# Altium project Fan_Controller_v1.2.PrjPcb
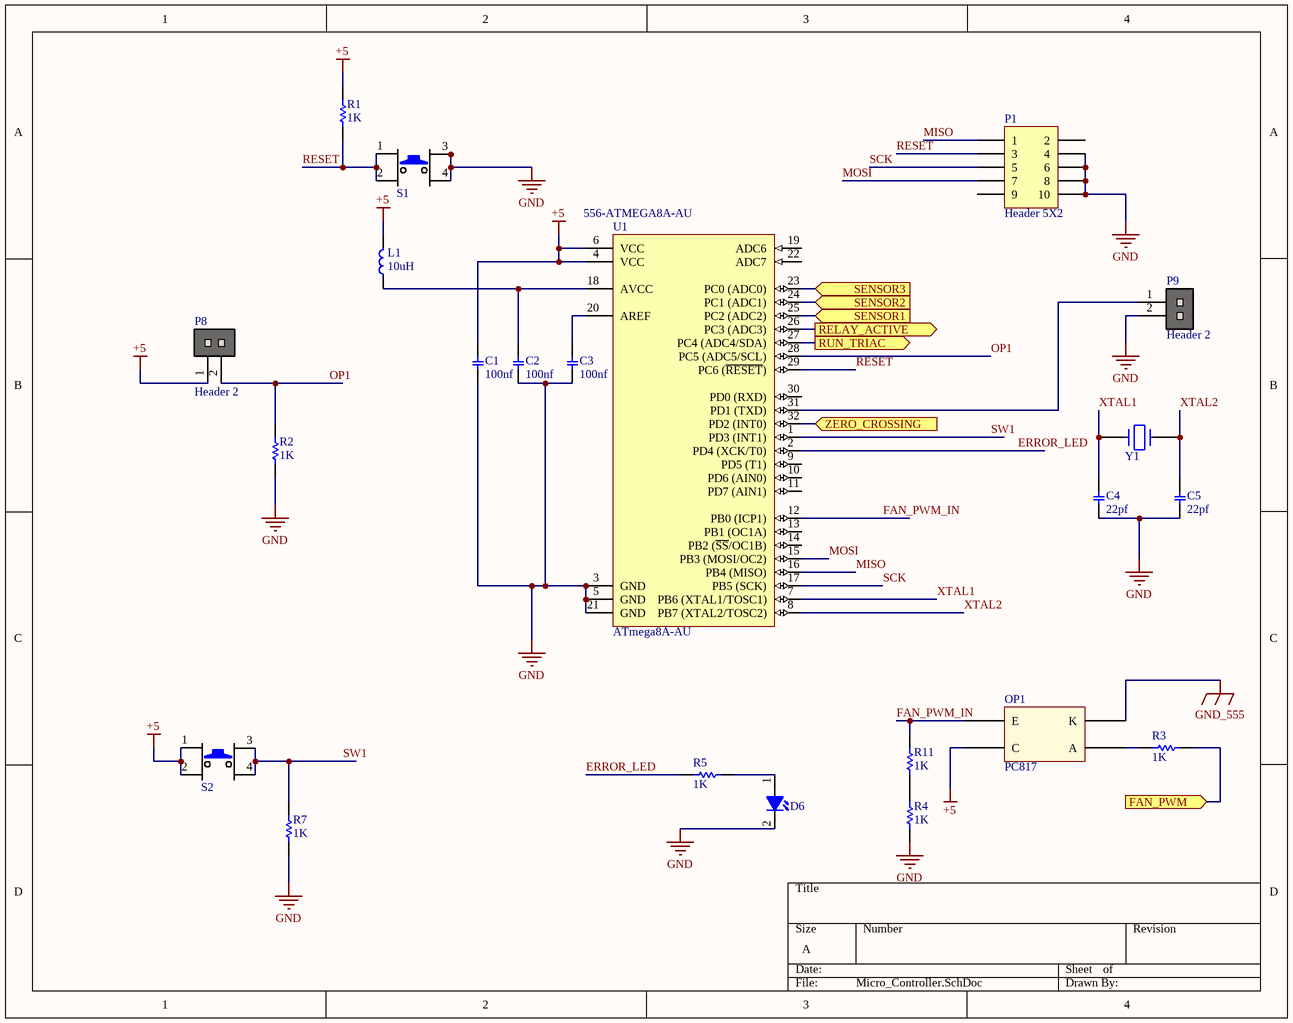
[diagram p0: Micro_Controller.SchDoc]
6 sheets, 94 parts. Net scope: flat (ports and power ports of the same name join across sheets).
Board file: PCB.PcbDoc
Sheets:
  Micro_Controller.SchDoc
  Fan_Feedback.SchDoc
  Motor_Controller.SchDoc
  Relay_Alert.SchDoc
  Power.SchDoc
  Sensors.SchDoc

## Sheet Micro_Controller.SchDoc
size A

### Parts
C1  value 100nf  [C1206]  (hidden comment: Capacitor C SMD 1206)
C2  value 100nf  [C1206]  (hidden comment: Capacitor C SMD 1206)
C3  value 100nf  [C1206]  (hidden comment: Capacitor C SMD 1206)
C4  value 22pf  [C1206]  (hidden comment: Capacitor C SMD 1206)
C5  value 22pf  [C1206]  (hidden comment: Capacitor C SMD 1206)
D6  LED THD 3mm  [LED THD 3mm (Green)]  (value not drawn)
L1  value 10uH  [L1206]  (hidden comment: Inductor SMD NC 1206)
OP1  PC817  [PC817 SMD]
P1  Header 5X2  [HDR2X5]
P8  Header 2  [HDR 1X2]
P9  Header 2  [HDR 1X2]
R1  value 1K  [SMD-1206-RES]  (hidden comment: Resistor SMD 1206)
R2  value 1K  [SMD-1206-RES]  (hidden comment: Resistor SMD 1206)
R3  value 1K  [SMD-1206-RES]  (hidden comment: Resistor SMD 1206)
R4  value 1K  [SMD-1206-RES]  (hidden comment: Resistor SMD 1206)
R5  value 1K  [SMD-1206-RES]  (hidden comment: Resistor SMD 1206)
R7  value 1K  [SMD-1206-RES]  (hidden comment: Resistor SMD 1206)
R11  value 1K  [SMD-1206-RES]  (hidden comment: Resistor SMD 1206)
S1  SW_PB4 THD  [SW THD 4 PIN (6)]  (value not drawn)
S2  SW_PB4 THD  [SW THD 4 PIN (6)]  (value not drawn)
U1  ATmega8A-AU  Supplier Part Number 1: 556-ATMEGA8A-AU  [32A_N]
Y1  Crystal  [Crystal 5 16MHZ]  (value not drawn)

### Ports
FAN_PWM (in), RELAY_ACTIVE (out), RUN_TRIAC (out), SENSOR1 (in), SENSOR2 (in), SENSOR3 (in), ZERO_CROSSING (in)

### Nets
+5: C1.2 L1.2 OP1.4(C) P8.1 R1.2 S2.1 S2.2 U1.4(VCC) U1.6(VCC)
GND: C1.1 C2.1 C3.1 C4.1 C5.1 D6.2(CATHODE) P1.4 P1.6 P1.8 P1.10 P9.2 R2.1 R4.1 R7.1 S1.3 S1.4 U1.3(GND) U1.5(GND) U1.21(GND)
GND_555: OP1.2(K)
ERROR_LED: R5.1 U1.2(PD4_(XCK/T0))
FAN_PWM_IN: OP1.3(E) R11.2 U1.12(PB0_(ICP1))
MISO: P1.1 U1.16(PB4_(MISO))
MOSI: P1.7 U1.15(PB3_(MOSI/OC2))
OP1: P8.2 R2.2 U1.28(PC5_(ADC5/SCL))
RESET: P1.3 R1.1 S1.1 S1.2 U1.29(PC6_(~{RESET}))
SCK: P1.5 U1.17(PB5_(SCK))
SW1: R7.2 S2.3 S2.4 U1.1(PD3_(INT1))
XTAL1: C4.2 U1.7(PB6_(XTAL1/TOSC1)) Y1.1
XTAL2: C5.2 U1.8(PB7_(XTAL2/TOSC2)) Y1.2
NetC2_2: C2.2 L1.1 U1.18(AVCC)
NetC3_2: C3.2 U1.20(AREF)
NetC23_2: U1.25(PC2_(ADC2)) ; port SENSOR1
NetC24_2: U1.24(PC1_(ADC1)) ; port SENSOR2
NetC25_2: U1.23(PC0_(ADC0)) ; port SENSOR3
NetConn1_4: R3.2 ; port FAN_PWM
NetD6_1: D6.1(ANODE) R5.2
NetOP1_1: OP1.1(A) R3.1
NetOP2_3: U1.32(PD2_(INT0)) ; port ZERO_CROSSING
NetP9_1: P9.1 U1.31(PD1_(TXD))
NetR4_2: R4.2 R11.1
NetR14_1: U1.27(PC4_(ADC4/SDA)) ; port RUN_TRIAC
NetR18_2: U1.26(PC3_(ADC3)) ; port RELAY_ACTIVE

Not connected (* = marked no-connect by the designer): P1 2 9; U1 9(PD5_(T1)) 10(PD6_(AIN0)) 11(PD7_(AIN1)) 13(PB1_(OC1A)) 14(PB2_(~{SS}/OC1B)) 19(ADC6) 22(ADC7) 30(PD0_(RXD))

### Library data of the parts
OP1 = PC817: PC817 optocpler; ComponentLink2Description: Website Smart World; ComponentLink2URL: https://www.smartw.ir/; ComponentLink3Description: Telegram; ComponentLink3URL: https://t.me/altium_smartw; ComponentLink4Description: Instagram; ComponentLink4URL: https://Instagram.com/smartgw.ir; DatasheetVersion: 2021
P1 = Header 5X2: Header, 5-Pin, Dual row; LatestRevisionDate: 17-Jul-2002; LatestRevisionNote: Re-released for DXP Platform.; Publisher: Altium Limited
P8 P9 = Header 2: Header, 2-Pin; ComponentLinkp-URL: https://www.smartw.ir/; DatasheetVersion: 2020
U1 = ATmega8A-AU: 8-bit AVR Microcontroller, 8KB Flash, 512 Bytes EEPROM, 1KB SRAM, 32-pin TQFP, Industrial Grade (-40°C to 85°C); ComponentLink1Description: Website Smart World; ComponentLink1URL: https://www.smartw.ir/; Supplier 1: Mouser
C1-C5 = Capacitor C SMD 1206: DatasheetVersion: 2021; ComponentLink1Description: Website Smart World; ComponentLink1URL: https://www.smartw.ir/; ComponentLink2Description: Telegram; ComponentLink2URL: https://t.me/altium_smartw; ComponentLink3Description: Instagram; ComponentLink3URL: https://Instagram.com/smartgw.ir
D6 = LED THD 3mm: ComponentLink1Description: Website Smart World; ComponentLink1URL: https://www.smartw.ir/; ComponentLink2Description: Telegram; ComponentLink2URL: https://t.me/altium_smartw; ComponentLink3Description: Instagram; ComponentLink3URL: https://Instagram.com/smartgw.ir; DatasheetVersion: 2021
L1 = Inductor SMD NC 1206: DatasheetVersion: 2021; ComponentLink1Description: Website Smart World; ComponentLink1URL: https://www.smartw.ir/; ComponentLink2Description: Telegram; ComponentLink2URL: https://t.me/altium_smartw; ComponentLink3Description: Instagram; ComponentLink3URL: https://Instagram.com/smartgw.ir
R1-R5 R7 R11 = Resistor SMD 1206: DatasheetVersion: 2021; ComponentLink1Description: Website Smart World; ComponentLink1URL: https://www.smartw.ir/; ComponentLink2Description: Telegram; ComponentLink2URL: https://t.me/altium_smartw; ComponentLink3Description: Instagram; ComponentLink3URL: https://Instagram.com/smartgw.ir
S1 S2 = SW_PB4 THD: ComponentLink1Description: Website Smart World; ComponentLink1URL: https://www.smartw.ir/; ComponentLink2Description: Telegram; ComponentLink2URL: https://t.me/altium_smartw; ComponentLink3Description: Instagram; ComponentLink3URL: https://Instagram.com/smartgw.ir; DatasheetVersion: 2021
Y1 = Crystal: ComponentLink1Description: Website Smart World; ComponentLink1URL: https://www.smartw.ir/; ComponentLink2Description: Telegram; ComponentLink2URL: https://t.me/altium_smartw; ComponentLink3Description: Instagram; ComponentLink3URL: https://Instagram.com/smartgw.ir; DatasheetVersion: 2021

## Sheet Fan_Feedback.SchDoc
size A
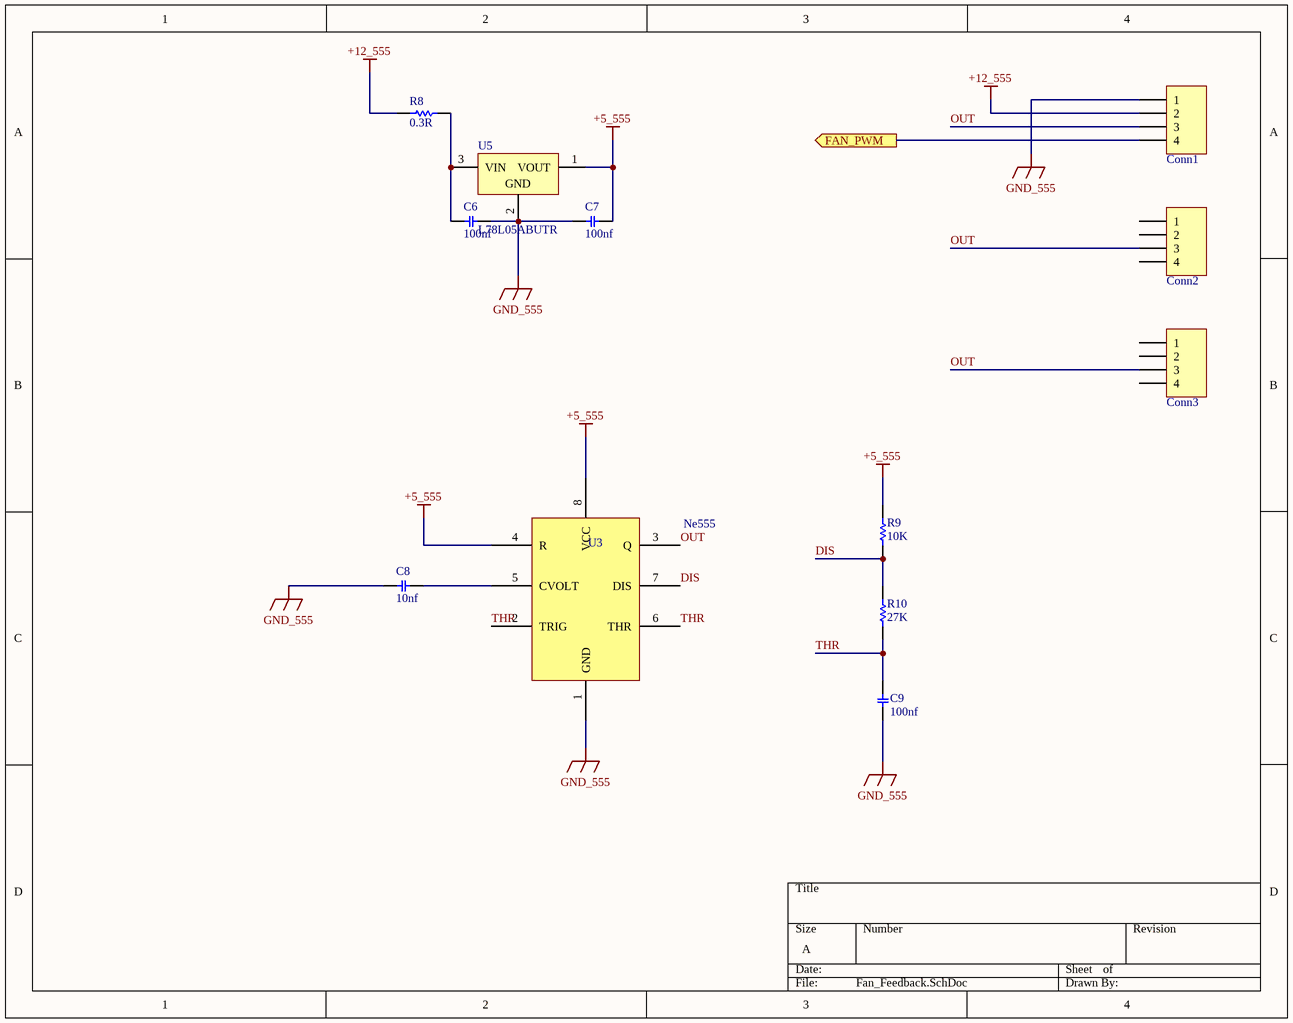
[diagram p1: Fan_Feedback.SchDoc]

### Parts
C6  value 100nf  [C1206]  (hidden comment: Capacitor C SMD 1206)
C7  value 100nf  [C1206]  (hidden comment: Capacitor C SMD 1206)
C8  value 10nf  [C1206]  (hidden comment: Capacitor C SMD 1206)
C9  value 100nf  [C1206]  (hidden comment: Capacitor C SMD 1206)
Conn1  Telecommunications_4pin  [Teleconn_4pin]  (value not drawn)
Conn2  Telecommunications_4pin  [Teleconn_4pin]  (value not drawn)
Conn3  Telecommunications_4pin  [Teleconn_4pin]  (value not drawn)
R8  value 0.3R  [SMD-1206-RES]  (hidden comment: Resistor SMD 1206)
R9  value 10K  [SMD-1206-RES]  (hidden comment: Resistor SMD 1206)
R10  value 27K  [SMD-1206-RES]  (hidden comment: Resistor SMD 1206)
U3  NE555  [NE555 SMD]
U5  L78L05ABUTR  [SOT-89_N]

### Ports
FAN_PWM (out)

### Nets
+5_555: C7.2 R9.2 U3.4(R) U3.8(VCC) U5.1(VOUT)
+12_555: Conn1.2 R8.1
GND_555: C6.2 C7.1 C8.1 C9.1 Conn1.1 U3.1(GND) U5.2(GND)
DIS: R9.1 R10.2 U3.7(DIS)
OUT: Conn1.3 Conn2.3 Conn3.3 U3.3(Q)
THR: C9.2 R10.1 U3.2(TRIG) U3.6(THR)
NetC6_1: C6.1 R8.2 U5.3(VIN)
NetC8_2: C8.2 U3.5(CVOLT)
NetConn1_4: Conn1.4 ; port FAN_PWM

Not connected (* = marked no-connect by the designer): Conn2 1 2 4; Conn3 1 2 4

### Library data of the parts
Conn1-Conn3 = Telecommunications_4pin: Telecommunications; ComponentLink1Description: Website Smart World; ComponentLink1URL: https://www.smartw.ir/; ComponentLink2Description: Telegram; ComponentLink2URL: https://t.me/altium_smartw; ComponentLink3Description: Instagram; ComponentLink3URL: https://Instagram.com/smartgw.ir; DatasheetVersion: 2021
U3 = NE555 2: ComponentLink1Description: Website Smart World; ComponentLink1URL: https://www.smartw.ir/; ComponentLink2Description: Telegram; ComponentLink2URL: https://t.me/altium_smartw; ComponentLink3Description: Instagram; ComponentLink3URL: https://Instagram.com/smartgw.ir; DatasheetVersion: 2021; Value: Ne555
U5 = CMP-0244-00406-1: Positive Voltage Regulator, 5V, 4-Pin SOT-89, Tape and Reel; PackageVersion: 2011; DatasheetVersion: 1/02/2011; PackageDescription: 3-Pin SOT-89 Package 1.5 mm Pitch, 4.1 mm Lead Span; PackageReference: SOT-89; ComponentLink2Description: Datasheet; ComponentLink1URL: http://www.st.com; ComponentLink1Description: Manufacturer URL; ComponentLink2URL: http://www.st.com/internet/com/TECHNICAL_RESOURCES/TECHNICAL_LITERATURE/DATASHEET/CD00000446.pdf
C6-C9 = Capacitor C SMD 1206: DatasheetVersion: 2021; ComponentLink1Description: Website Smart World; ComponentLink1URL: https://www.smartw.ir/; ComponentLink2Description: Telegram; ComponentLink2URL: https://t.me/altium_smartw; ComponentLink3Description: Instagram; ComponentLink3URL: https://Instagram.com/smartgw.ir
R8-R10 = Resistor SMD 1206: DatasheetVersion: 2021; ComponentLink1Description: Website Smart World; ComponentLink1URL: https://www.smartw.ir/; ComponentLink2Description: Telegram; ComponentLink2URL: https://t.me/altium_smartw; ComponentLink3Description: Instagram; ComponentLink3URL: https://Instagram.com/smartgw.ir

## Sheet Motor_Controller.SchDoc
size A
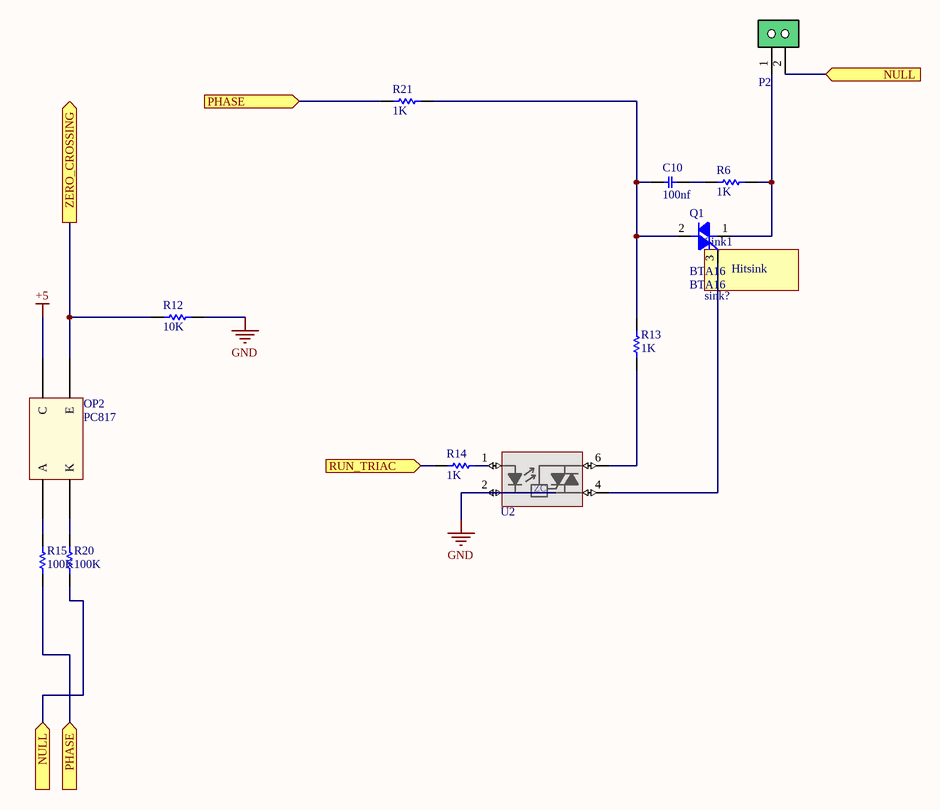
[diagram p2: Motor_Controller.SchDoc]

### Parts
C10  value 100nf  [C_PLY_13X5]  (hidden comment: Capacitor Polyester THD)
OP2  PC817  [PC817 SMD]
P2  Phoenix 2  [PRKR2A]  (value not drawn)
Q1  BTA16  [TO220]
R6  value 1K  [R05W_AX05]  (hidden comment: Resistor THD)
R12  value 10K  [SMD-1206-RES]  (hidden comment: Resistor SMD 1206)
R13  value 1K  [SMD-1206-RES]  (hidden comment: Resistor SMD 1206)
R14  value 1K  [SMD-1206-RES]  (hidden comment: Resistor SMD 1206)
R15  value 100K  [R2W_AX08]  (hidden comment: Resistor THD)
R20  value 100K  [R2W_AX08]  (hidden comment: Resistor THD)
R21  value 1K  [SMD-1206-RES]  (hidden comment: Resistor SMD 1206)
Sink1  sink?  [heatsink (4)]
U2  MOC30XX  [DIP-6 white]  (value not drawn)

### Ports
NULL (in), PHASE (in), RUN_TRIAC (in), ZERO_CROSSING (out)

### Nets
+5: OP2.4(C)
GND: R12.2 U2.2(K)
NetC10_1: C10.1 Q1.2(T2) R13.2 R21.2
NetC10_2: C10.2 R6.1
NetDB1_4: P2.2 R20.1 ; port NULL
NetOP2_1: OP2.1(A) R15.2
NetOP2_2: OP2.2(K) R20.2
NetOP2_3: OP2.3(E) R12.1 ; port ZERO_CROSSING
NetP2_1: P2.1 Q1.1(T1) R6.2
NetP4_2: R15.1 R21.1 ; port PHASE
NetQ1_3: Q1.3(G) U2.4(T2)
NetR13_1: R13.1 U2.6(T1)
NetR14_1: R14.1 ; port RUN_TRIAC
NetR14_2: R14.2 U2.1(A)

### Notes on the sheet
- (in symbol MOC30XX) ZC

### Library data of the parts
OP2 = PC817: PC817 optocpler; ComponentLink2Description: Website Smart World; ComponentLink2URL: https://www.smartw.ir/; ComponentLink3Description: Telegram; ComponentLink3URL: https://t.me/altium_smartw; ComponentLink4Description: Instagram; ComponentLink4URL: https://Instagram.com/smartgw.ir; DatasheetVersion: 2021
Q1 = BTA16: Triac, 800V, 16A, TO-220; ComponentLink1Description: Website Smart World; ComponentLink1URL: https://www.smartw.ir/; ComponentLink2Description: Telegram; ComponentLink2URL: https://t.me/altium_smartw; ComponentLink3Description: Instagram; ComponentLink3URL: https://Instagram.com/smartgw.ir; DatasheetVersion: 2021; VALUE: BTA16
Sink1 = Hitsink
U2 = MOC30XX: Single Channel Zero-Crossing Random-Phase Optoisolators Triac Driver (600 Volt Peak) , Isolation Voltage 7500Vac(pk); ComponentLink1Description: Website Smart World; ComponentLink1URL: https://www.smartw.ir/; ComponentLink2Description: Telegram; ComponentLink2URL: https://t.me/altium_smartw; ComponentLink3Description: Instagram; ComponentLink3URL: https://Instagram.com/smartgw.ir; DatasheetVersion: 2021
C10 = Capacitor Polyester THD: DatasheetVersion: 2021; ComponentLink1Description: Website Smart World; ComponentLink1URL: https://www.smartw.ir/; ComponentLink2Description: Telegram; ComponentLink2URL: https://t.me/altium_smartw; ComponentLink3Description: Instagram; ComponentLink3URL: https://Instagram.com/smartgw.ir
P2 = Phoenix 2: ComponentLinkp-URL: https://www.smartw.ir/; DatasheetVersion: 2021; ComponentLink1Description: Website Smart World; ComponentLink1URL: https://www.smartw.ir/; ComponentLink2Description: Telegram; ComponentLink2URL: https://t.me/altium_smartw; ComponentLink3Description: Instagram; ComponentLink3URL: https://Instagram.com/smartgw.ir
R6 R15 R20 = Resistor THD: DatasheetVersion: 2021; ComponentLink1Description: Website Smart World; ComponentLink1URL: https://www.smartw.ir/; ComponentLink2Description: Telegram; ComponentLink2URL: https://t.me/altium_smartw; ComponentLink3Description: Instagram; ComponentLink3URL: https://Instagram.com/smartgw.ir
R12-R14 R21 = Resistor SMD 1206: DatasheetVersion: 2021; ComponentLink1Description: Website Smart World; ComponentLink1URL: https://www.smartw.ir/; ComponentLink2Description: Telegram; ComponentLink2URL: https://t.me/altium_smartw; ComponentLink3Description: Instagram; ComponentLink3URL: https://Instagram.com/smartgw.ir

## Sheet Relay_Alert.SchDoc
size A
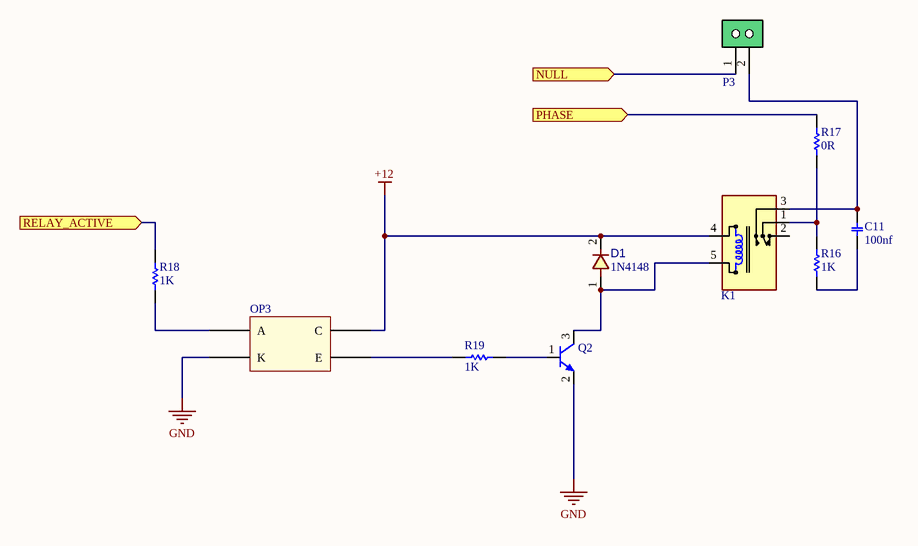
[diagram p3: Relay_Alert.SchDoc]

### Parts
C11  value 100nf  [C_PLY_13X5]  (hidden comment: Capacitor Polyester THD)
D1  value 1N4148  [D_SOD80]  (hidden comment: 1N4148 SMD)
K1  RELAY SPST 5 Pin Bache Millon  [REL_SPDT_5_1512]  (value not drawn)
OP3  PC817  [PC817 SMD]  (value not drawn)
P3  Phoenix 2  [PRKR2A]  (value not drawn)
Q2  BC847 NPN  [SOT-23]  (value not drawn)
R16  value 1K  [R05W_AX05]  (hidden comment: Resistor THD)
R17  value 0R  [SMD-1206-RES]  (hidden comment: Resistor SMD 1206)
R18  value 1K  [SMD-1206-RES]  (hidden comment: Resistor SMD 1206)
R19  value 1K  [SMD-1206-RES]  (hidden comment: Resistor SMD 1206)

### Ports
NULL (in), PHASE (in), RELAY_ACTIVE (in)

### Nets
+12: D1.2 K1.4(T1) OP3.4(C)
GND: OP3.2(K) Q2.2(E)
NetC11_1: C11.1 R16.1
NetC11_2: C11.2 K1.3(NO) P3.2
NetD1_1: D1.1 K1.5(T2) Q2.3(C)
NetDB1_4: P3.1 ; port NULL
NetK1_1: K1.1(COM) R16.2 R17.1
NetOP3_1: OP3.1(A) R18.1
NetOP3_3: OP3.3(E) R19.1
NetP4_2: R17.2 ; port PHASE
NetQ2_1: Q2.1(B) R19.2
NetR18_2: R18.2 ; port RELAY_ACTIVE

Not connected (* = marked no-connect by the designer): K1 2(NC)

### Library data of the parts
D1 = 1N4148 SMD: DIODE, FAST SWTICHING, 0.3A, 0.5W; DatasheetVersion: 2021; ComponentLink1Description: Website Smart World; ComponentLink1URL: https://www.smartw.ir/; ComponentLink2Description: Telegram; ComponentLink2URL: https://t.me/altium_smartw; ComponentLink3Description: Instagram; ComponentLink3URL: https://Instagram.com/smartgw.ir
K1 = RELAY SPST 5 Pin Bache Millon: Relay; ComponentLinkp-URL: https://www.smartw.ir/; DatasheetVersion: 2021; ComponentLink1Description: Website Smart World; ComponentLink1URL: https://www.smartw.ir/; ComponentLink2Description: Telegram; ComponentLink2URL: https://t.me/altium_smartw; ComponentLink3Description: Instagram; ComponentLink3URL: https://Instagram.com/smartgw.ir
OP3 = PC817: PC817 optocpler; ComponentLink2Description: Website Smart World; ComponentLink2URL: https://www.smartw.ir/; ComponentLink3Description: Telegram; ComponentLink3URL: https://t.me/altium_smartw; ComponentLink4Description: Instagram; ComponentLink4URL: https://Instagram.com/smartgw.ir; DatasheetVersion: 2021
Q2 = BC847 NPN: BJT, NPN, 45v, 0.1A, SOT23; ComponentLink1Description: Website Smart World; ComponentLink1URL: https://www.smartw.ir/; ComponentLink2Description: Telegram; ComponentLink2URL: https://t.me/altium_smartw; ComponentLink3Description: Instagram; ComponentLink3URL: https://Instagram.com/smartgw.ir; DatasheetVersion: 2021; Value: BC847
C11 = Capacitor Polyester THD: DatasheetVersion: 2021; ComponentLink1Description: Website Smart World; ComponentLink1URL: https://www.smartw.ir/; ComponentLink2Description: Telegram; ComponentLink2URL: https://t.me/altium_smartw; ComponentLink3Description: Instagram; ComponentLink3URL: https://Instagram.com/smartgw.ir
P3 = Phoenix 2: ComponentLinkp-URL: https://www.smartw.ir/; DatasheetVersion: 2021; ComponentLink1Description: Website Smart World; ComponentLink1URL: https://www.smartw.ir/; ComponentLink2Description: Telegram; ComponentLink2URL: https://t.me/altium_smartw; ComponentLink3Description: Instagram; ComponentLink3URL: https://Instagram.com/smartgw.ir
R16 = Resistor THD: DatasheetVersion: 2021; ComponentLink1Description: Website Smart World; ComponentLink1URL: https://www.smartw.ir/; ComponentLink2Description: Telegram; ComponentLink2URL: https://t.me/altium_smartw; ComponentLink3Description: Instagram; ComponentLink3URL: https://Instagram.com/smartgw.ir
R17-R19 = Resistor SMD 1206: DatasheetVersion: 2021; ComponentLink1Description: Website Smart World; ComponentLink1URL: https://www.smartw.ir/; ComponentLink2Description: Telegram; ComponentLink2URL: https://t.me/altium_smartw; ComponentLink3Description: Instagram; ComponentLink3URL: https://Instagram.com/smartgw.ir

## Sheet Power.SchDoc
size A
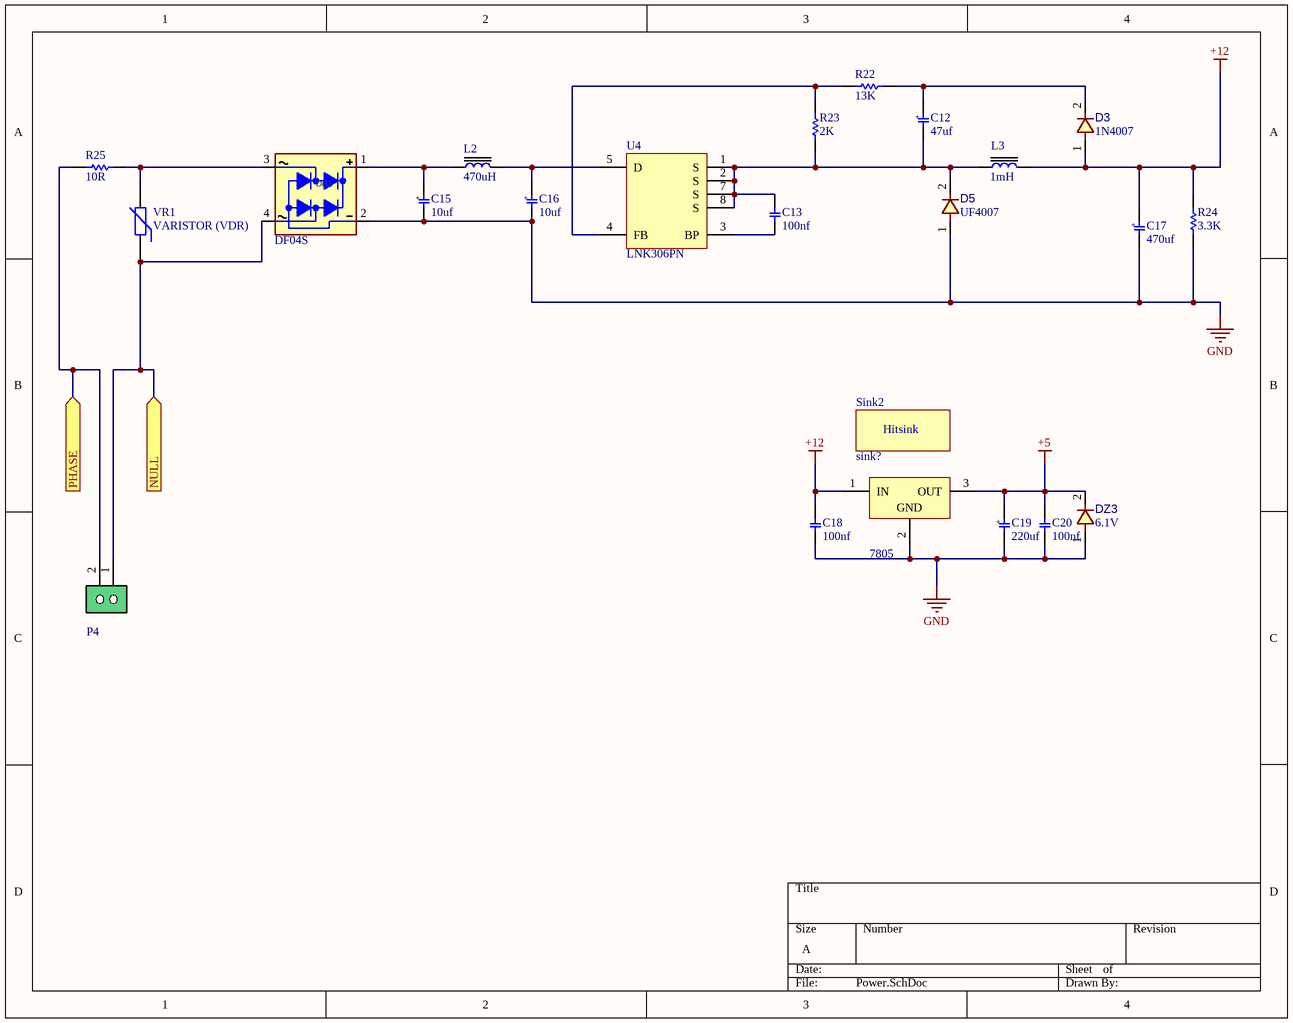
[diagram p4: Power.SchDoc]

### Parts
7805  7805CV  [TO220]  (value not drawn)
C12  value 47uf  [C_EL_6X11]  (hidden comment: Capacitor Electrical THD)
C13  value 100nf  [C1206]  (hidden comment: Capacitor C SMD 1206)
C15  value 10uf  [C_EL_10X20]  (hidden comment: Capacitor Electrical THD)
C16  value 10uf  [C_EL_10X20]  (hidden comment: Capacitor Electrical THD)
C17  value 470uf  [C_EL_10X20]  (hidden comment: Capacitor Electrical THD)
C18  value 100nf  [C1206]  (hidden comment: Capacitor C SMD 1206)
C19  value 220uf  [C_EL_5X7]  (hidden comment: Capacitor Electrical THD)
C20  value 100nf  [C1206]  (hidden comment: Capacitor C SMD 1206)
D3  value 1N4007  [D_SMA]  (hidden comment: 1N4007 SMD M7)
D5  value UF4007  [D_SMA]  (hidden comment: 1N4007 SMD M7)
DB1  value DF04S  [DBRG_DIPSMD]  (hidden comment: Diode Bridge SMD)
DZ3  value 6.1V  [D_SOD80]  (hidden comment: 1N4148 SMD)
L2  value 470uH  [LT_AX04]  (hidden comment: Inductor THD)
L3  value 1mH  [LT_C10]  (hidden comment: Inductor THD)
P4  Phoenix 2  [PRKR2A]  (value not drawn)
R22  value 13K  [Res-(1/4)]  (hidden comment: Resistor THD)
R23  value 2K  [Res-(1/4)]  (hidden comment: Resistor THD)
R24  value 3.3K  [SMD-1206-RES]  (hidden comment: Resistor SMD 1206)
R25  value 10R  [R2W_AX08]  (hidden comment: Resistor THD)
Sink2  sink?  [heatsink (4)]
U4  LNK306PN  [PI-DIP-8B]
VR1  VARISTOR (VDR)  [Varistor Short  Vertical]

### Ports
NULL (in), PHASE (in)

### Nets
+5: 7805.3(OUT) C19.1 C20.2 DZ3.2
+12: 7805.1(IN) C17.1 C18.2 D3.1 L3.2 R24.2
GND: 7805.2(GND) C15.2 C16.2 C17.2 C18.1 C19.2 C20.1 D5.1 DB1.2(DCOUT-) DZ3.1 R24.1
NetC12_1: C12.1 D3.2 R22.2
NetC12_2: C12.2 C13.2 D5.2 L3.1 R23.1 U4.1(S) U4.2(S) U4.7(S) U4.8(S)
NetC13_1: C13.1 U4.3(BP)
NetC15_1: C15.1 DB1.1(DCOUT+) L2.1
NetC16_1: C16.1 L2.2 U4.5(D)
NetDB1_3: DB1.3(ACIN2) R25.2 VR1.2
NetDB1_4: DB1.4(ACIN1) P4.1 VR1.1 ; port NULL
NetP4_2: P4.2 R25.1 ; port PHASE
NetR22_1: R22.1 R23.2 U4.4(FB)

### Notes on the sheet
- (in symbol Capacitor Electrical THD) +

### Library data of the parts
7805 = 7805: ComponentLink1Description: Website Smart World; ComponentLink1URL: https://www.smartw.ir/; ComponentLink2Description: Telegram; ComponentLink2URL: https://t.me/altium_smartw; ComponentLink3Description: Instagram; ComponentLink3URL: https://Instagram.com/smartgw.ir; DatasheetVersion: 2021
D3 D5 = 1N4007 SMD M7: DIODE, GENERAL PURPOSE, 1000V/1A; DatasheetVersion: 2021; ComponentLink1Description: Website Smart World; ComponentLink1URL: https://www.smartw.ir/; ComponentLink2Description: Telegram; ComponentLink2URL: https://t.me/altium_smartw; ComponentLink3Description: Instagram; ComponentLink3URL: https://Instagram.com/smartgw.ir
DB1 = Diode Bridge SMD: DIODE, BRIDGE,; DatasheetVersion: 2021; ComponentLink1Description: Website Smart World; ComponentLink1URL: https://www.smartw.ir/; ComponentLink2Description: Telegram; ComponentLink2URL: https://t.me/altium_smartw; ComponentLink3Description: Instagram; ComponentLink3URL: https://Instagram.com/smartgw.ir
DZ3 = 1N4148 SMD: DIODE, FAST SWTICHING, 0.3A, 0.5W; DatasheetVersion: 2021; ComponentLink1Description: Website Smart World; ComponentLink1URL: https://www.smartw.ir/; ComponentLink2Description: Telegram; ComponentLink2URL: https://t.me/altium_smartw; ComponentLink3Description: Instagram; ComponentLink3URL: https://Instagram.com/smartgw.ir
Sink2 = Hitsink
U4 = CMP-2000-06570-1: Lowest Component Count, Energy-Efficient Off-Line Switcher IC, 85 to 265 V Input, -40 to 150 degC, 7-Pin PDIP (P), RoHS, Tube; Manufacturer: Power Integrations; Input voltage: 85...265VAC; Function: Regulator; Output type: Adjustable; Topology: Flyback; Mounting Technology: ThroughHole; Manufacturer URL: https://www.power.com/; Package: DIP-8B(7-lead); Datasheet Version: Rev. J, 06/2013; Datasheet URL: http://www.mouser.com/ds/2/328/lnk302_304-306-179954.pdf; Package Description: 7-Pin Double In-line Package, Body 6.35 x 9.575 mm, Pitch 2.54 mm; Package Reference: DIP-8B
VR1 = VARISTOR (VDR): VARISTORS; ComponentLink1Description: Website Smart World; ComponentLink1URL: https://www.smartw.ir/; ComponentLink2Description: Telegram; ComponentLink2URL: https://t.me/altium_smartw; ComponentLink3Description: Instagram; ComponentLink3URL: https://Instagram.com/smartgw.ir; DatasheetVersion: 2021
C12 C15-C17 C19 = Capacitor Electrical THD: DatasheetVersion: 2021; ComponentLink1Description: Website Smart World; ComponentLink1URL: https://www.smartw.ir/; ComponentLink2Description: Telegram; ComponentLink2URL: https://t.me/altium_smartw; ComponentLink3Description: Instagram; ComponentLink3URL: https://Instagram.com/smartgw.ir
C13 C18 C20 = Capacitor C SMD 1206: DatasheetVersion: 2021; ComponentLink1Description: Website Smart World; ComponentLink1URL: https://www.smartw.ir/; ComponentLink2Description: Telegram; ComponentLink2URL: https://t.me/altium_smartw; ComponentLink3Description: Instagram; ComponentLink3URL: https://Instagram.com/smartgw.ir
L2 L3 = Inductor THD: DatasheetVersion: 2021; ComponentLink1Description: Website Smart World; ComponentLink1URL: https://www.smartw.ir/; ComponentLink2Description: Telegram; ComponentLink2URL: https://t.me/altium_smartw; ComponentLink3Description: Instagram; ComponentLink3URL: https://Instagram.com/smartgw.ir
P4 = Phoenix 2: ComponentLinkp-URL: https://www.smartw.ir/; DatasheetVersion: 2021; ComponentLink1Description: Website Smart World; ComponentLink1URL: https://www.smartw.ir/; ComponentLink2Description: Telegram; ComponentLink2URL: https://t.me/altium_smartw; ComponentLink3Description: Instagram; ComponentLink3URL: https://Instagram.com/smartgw.ir
R22 R23 R25 = Resistor THD: DatasheetVersion: 2021; ComponentLink1Description: Website Smart World; ComponentLink1URL: https://www.smartw.ir/; ComponentLink2Description: Telegram; ComponentLink2URL: https://t.me/altium_smartw; ComponentLink3Description: Instagram; ComponentLink3URL: https://Instagram.com/smartgw.ir
R24 = Resistor SMD 1206: DatasheetVersion: 2021; ComponentLink1Description: Website Smart World; ComponentLink1URL: https://www.smartw.ir/; ComponentLink2Description: Telegram; ComponentLink2URL: https://t.me/altium_smartw; ComponentLink3Description: Instagram; ComponentLink3URL: https://Instagram.com/smartgw.ir

## Sheet Sensors.SchDoc
size A
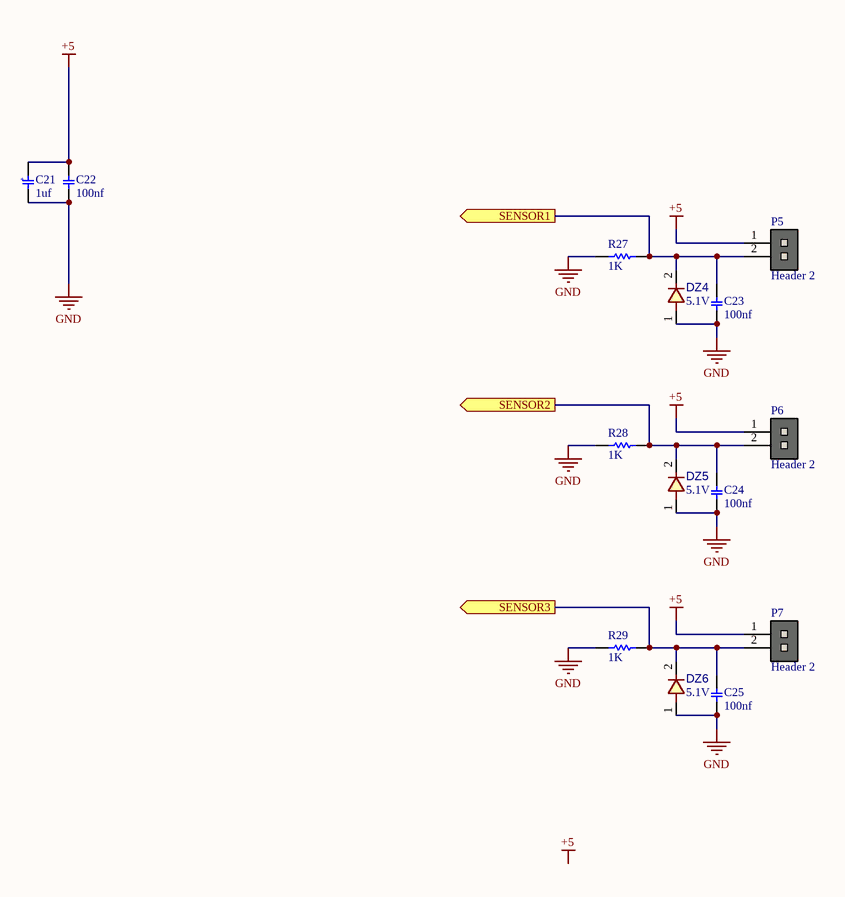
[diagram p5: Sensors.SchDoc]

### Parts
C21  value 1uf  [C_EL_4X7]  (hidden comment: Capacitor Electrical THD)
C22  value 100nf  [C1206]  (hidden comment: Capacitor C SMD 1206)
C23  value 100nf  [C1206]  (hidden comment: Capacitor C SMD 1206)
C24  value 100nf  [C1206]  (hidden comment: Capacitor C SMD 1206)
C25  value 100nf  [C1206]  (hidden comment: Capacitor C SMD 1206)
DZ4  value 5.1V  [D_SOD80]  (hidden comment: 1N4148 SMD)
DZ5  value 5.1V  [D_SOD80]  (hidden comment: 1N4148 SMD)
DZ6  value 5.1V  [D_SOD80]  (hidden comment: 1N4148 SMD)
P5  Header 2  [HDR 1X2]
P6  Header 2  [HDR 1X2]
P7  Header 2  [HDR 1X2]
R27  value 1K  [SMD-1206-RES]  (hidden comment: Resistor SMD 1206)
R28  value 1K  [SMD-1206-RES]  (hidden comment: Resistor SMD 1206)
R29  value 1K  [SMD-1206-RES]  (hidden comment: Resistor SMD 1206)

### Ports
SENSOR1 (out), SENSOR2 (out), SENSOR3 (out)

### Nets
+5: C21.1 C22.2 P5.1 P6.1 P7.1
GND: C21.2 C22.1 C23.1 C24.1 C25.1 DZ4.1 DZ5.1 DZ6.1 R27.1 R28.1 R29.1
NetC23_2: C23.2 DZ4.2 P5.2 R27.2 ; port SENSOR1
NetC24_2: C24.2 DZ5.2 P6.2 R28.2 ; port SENSOR2
NetC25_2: C25.2 DZ6.2 P7.2 R29.2 ; port SENSOR3

### Notes on the sheet
- Labels drawn without touching a wire or pin: +5
- (in symbol Capacitor Electrical THD) +

### Library data of the parts
DZ4-DZ6 = 1N4148 SMD: DIODE, FAST SWTICHING, 0.3A, 0.5W; DatasheetVersion: 2021; ComponentLink1Description: Website Smart World; ComponentLink1URL: https://www.smartw.ir/; ComponentLink2Description: Telegram; ComponentLink2URL: https://t.me/altium_smartw; ComponentLink3Description: Instagram; ComponentLink3URL: https://Instagram.com/smartgw.ir
P5-P7 = Header 2: Header, 2-Pin; ComponentLinkp-URL: https://www.smartw.ir/; DatasheetVersion: 2020
C21 = Capacitor Electrical THD: DatasheetVersion: 2021; ComponentLink1Description: Website Smart World; ComponentLink1URL: https://www.smartw.ir/; ComponentLink2Description: Telegram; ComponentLink2URL: https://t.me/altium_smartw; ComponentLink3Description: Instagram; ComponentLink3URL: https://Instagram.com/smartgw.ir
C22-C25 = Capacitor C SMD 1206: DatasheetVersion: 2021; ComponentLink1Description: Website Smart World; ComponentLink1URL: https://www.smartw.ir/; ComponentLink2Description: Telegram; ComponentLink2URL: https://t.me/altium_smartw; ComponentLink3Description: Instagram; ComponentLink3URL: https://Instagram.com/smartgw.ir
R27-R29 = Resistor SMD 1206: DatasheetVersion: 2021; ComponentLink1Description: Website Smart World; ComponentLink1URL: https://www.smartw.ir/; ComponentLink2Description: Telegram; ComponentLink2URL: https://t.me/altium_smartw; ComponentLink3Description: Instagram; ComponentLink3URL: https://Instagram.com/smartgw.ir

## Nets that join several sheets
+5: Micro_Controller (9 pins), Motor_Controller (OP2.4), Power (7805.3 C19.1 C20.2 DZ3.2), Sensors (5 pins)
+12: Relay_Alert (D1.2 K1.4 OP3.4), Power (6 pins)
GND: Micro_Controller (19 pins), Motor_Controller (R12.2 U2.2), Relay_Alert (OP3.2 Q2.2), Power (11 pins), Sensors (11 pins)
GND_555: Micro_Controller (OP1.2), Fan_Feedback (7 pins)
NetC23_2: Micro_Controller (U1.25), Sensors (C23.2 DZ4.2 P5.2 R27.2)
NetC24_2: Micro_Controller (U1.24), Sensors (C24.2 DZ5.2 P6.2 R28.2)
NetC25_2: Micro_Controller (U1.23), Sensors (C25.2 DZ6.2 P7.2 R29.2)
NetConn1_4: Micro_Controller (R3.2), Fan_Feedback (Conn1.4)
NetDB1_4: Motor_Controller (P2.2 R20.1), Relay_Alert (P3.1), Power (DB1.4 P4.1 VR1.1)
NetOP2_3: Micro_Controller (U1.32), Motor_Controller (OP2.3 R12.1)
NetP4_2: Motor_Controller (R15.1 R21.1), Relay_Alert (R17.2), Power (P4.2 R25.1)
NetR14_1: Micro_Controller (U1.27), Motor_Controller (R14.1)
NetR18_2: Micro_Controller (U1.26), Relay_Alert (R18.2)